# Altium project Mini smart home.PrjPcb
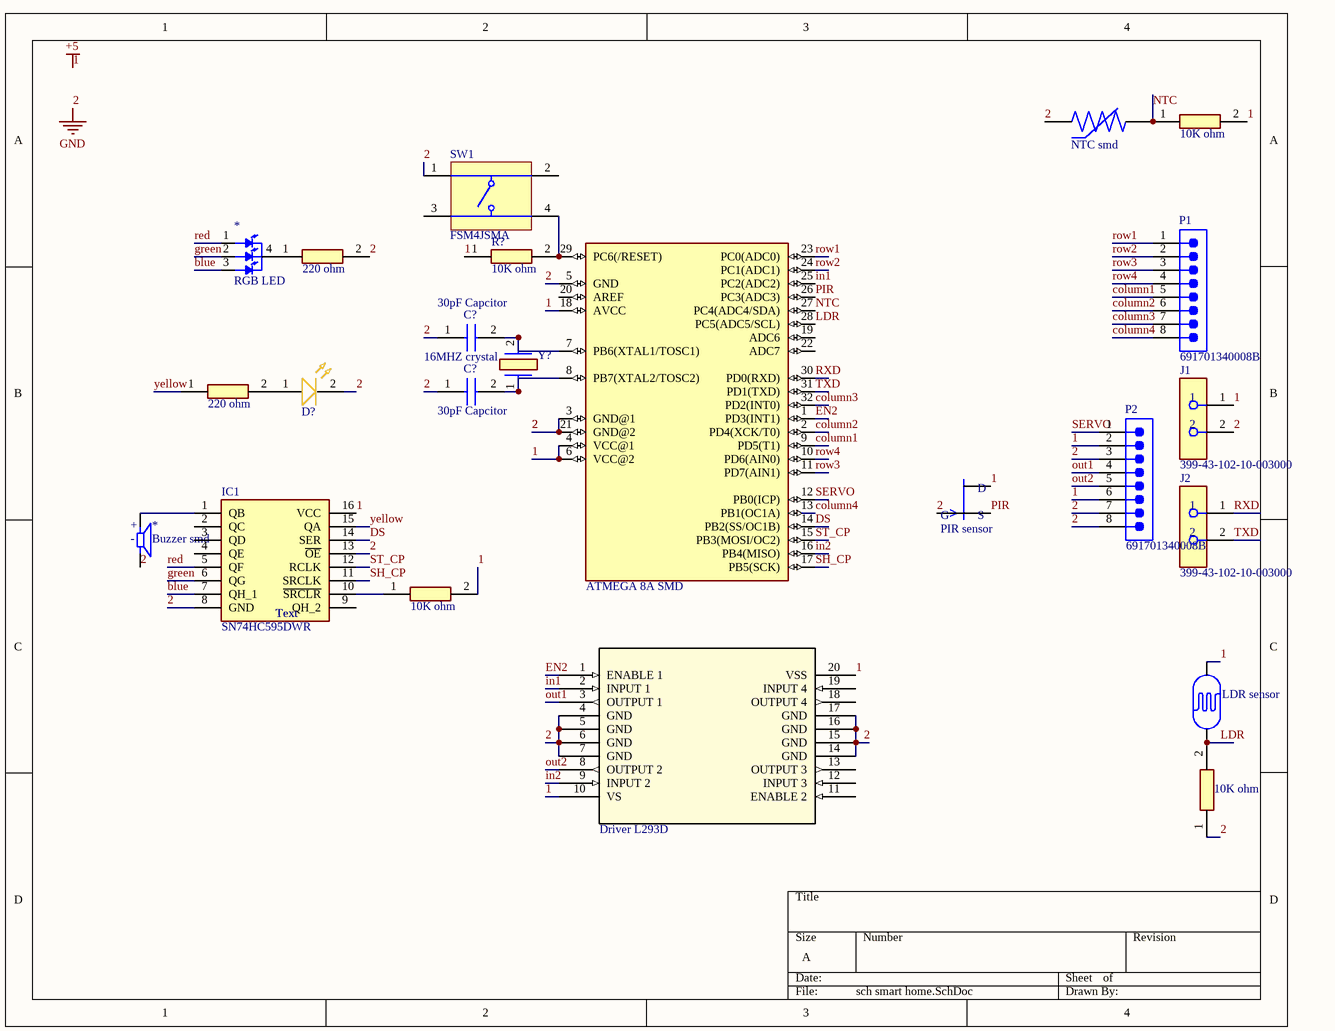
[diagram p0: sch smart home.SchDoc]
1 sheet, 23 parts. Net scope: global (net labels, ports and power ports of the same name join across sheets).
Board file: PCB smart home.PcbDoc

## Sheet sch smart home.SchDoc
size A; SheetNumber: 1; SheetTotal: 1

### Parts
(Parts that share a designator on the sheet are numbered #1, #2 ... from top to bottom, then left to right.)
16MHZ_Crystal  16MHZ crystal  [16MHZ crystal]
Buzzer  NTC smd  [NTC smd]
C1  30pF Capcitor  [30pF Capcitor]
C2  30pF Capcitor  [30pF Capcitor]
D1  LED  [LED]  (value not drawn)
IC1  SN74HC595DWR  [HC595N]
J1  399-43-102-10-003000  [FP-399-43-102-10-003000-MFG]
J2  399-43-102-10-003000  [FP-399-43-102-10-003000-MFG]
L293D_Driver  Driver L293D  [L293D]
LDR  LDR sensor  [LDR sensor]
Mini_Smart_Home  Buzzer smd  [buzzer smd]
NTC  ATMEGA 8A SMD  [ATMEGA 8A SMD]
P1  691701340008B  [691701340008B]
P2  691701340008B  [691701340008B]
PIR_sensor  PIR sensor  [PIR sensor]
R2  10K ohm  [10k OHM]
R#1  10K ohm  [10k OHM]
R#2  220 ohm  [220 OHM]
R#3  220 ohm  [220 OHM]
R#4  10K ohm  [10k OHM]
R#5  10K ohm  [10k OHM]
RGB  RGB LED  [RGB LED]
SW1  FSM4JSMA  [TECO-FSM4JSMA_V]

### Nets
1: IC1.16(VCC) J1.1 L293D_Driver.10(VS) L293D_Driver.20(VSS) LDR.2 NTC.4(VCC@1) NTC.6(VCC@2) NTC.18(AVCC) P2.2 P2.6 PIR_sensor.1(D) R2.1 R#1.2 R#4.2  [also labelled +5]
2: Buzzer.1 C1.1 C2.1 D1.2 IC1.8(GND) IC1.13(~{OE}) J1.2 L293D_Driver.4(GND) L293D_Driver.5(GND) L293D_Driver.6(GND) L293D_Driver.7(GND) L293D_Driver.14(GND) L293D_Driver.15(GND) L293D_Driver.16(GND) L293D_Driver.17(GND) Mini_Smart_Home.2(N) NTC.3(GND@1) NTC.5(GND) NTC.21(GND@2) P2.3 P2.7 P2.8 PIR_sensor.3(G) R#2.2 R#5.1 SW1.1  [also labelled GND]
blue: IC1.7(QH_1) RGB.3(BLUE)
column1: NTC.9(PD5(T1)) P1.5
column2: NTC.2(PD4(XCK/T0)) P1.6
column3: NTC.32(PD2(INT0)) P1.7
column4: NTC.13(PB1(OC1A)) P1.8
DS: IC1.14(SER) NTC.14(PB2(SS/OC1B))
EN2: L293D_Driver.1(ENABLE_1) NTC.1(PD3(INT1))
green: IC1.6(QG) RGB.2(GREEN)
in1: L293D_Driver.2(INPUT_1) NTC.25(PC2(ADC2))
in2: L293D_Driver.9(INPUT_2) NTC.16(PB4(MISO))
LDR: LDR.1 NTC.28(PC5(ADC5/SCL)) R#5.2
NTC: Buzzer.2 NTC.27(PC4(ADC4/SDA)) R#1.1
out1: L293D_Driver.3(OUTPUT_1) P2.4
out2: L293D_Driver.8(OUTPUT_2) P2.5
PIR: NTC.26(PC3(ADC3)) PIR_sensor.2(S)
red: IC1.5(QF) RGB.1(RED)
row1: NTC.23(PC0(ADC0)) P1.1
row2: NTC.24(PC1(ADC1)) P1.2
row3: NTC.11(PD7(AIN1)) P1.3
row4: NTC.10(PD6(AIN0)) P1.4
RXD: J2.1 NTC.30(PD0(RXD))
SERVO: NTC.12(PB0(ICP)) P2.1
SH_CP: IC1.11(SRCLK) NTC.17(PB5(SCK))
ST_CP: IC1.12(RCLK) NTC.15(PB3(MOSI/OC2))
TXD: J2.2 NTC.31(PD1(TXD))
yellow: IC1.15(QA) R#3.1
Net16MHZ_Crystal_1: 16MHZ_Crystal.1 C2.2 NTC.8(PB7(XTAL2/TOSC2))
Net16MHZ_Crystal_2: 16MHZ_Crystal.2 C1.2 NTC.7(PB6(XTAL1/TOSC1))
NetD1_1: D1.1 R#3.2
NetIC1_1: IC1.1(QB) Mini_Smart_Home.1(P)
NetIC1_10: IC1.10(~{SRCLR}) R#4.1
NetNTC_29: NTC.29(PC6(/RESET)) R2.2 SW1.4
NetR#2_1: R#2.1 RGB.4(CATHODE)

Not connected (* = marked no-connect by the designer): IC1 2(QC) 3(QD) 4(QE) 9(QH_2); L293D_Driver 11(ENABLE_2) 12(INPUT_3) 13(OUTPUT_3) 18(OUTPUT_4) 19(INPUT_4); NTC 19(ADC6) 20(AREF) 22(ADC7); SW1 2 3

### Notes on the sheet
- (near IC1) Text
- (in symbol Buzzer smd) +; -

### Library data of the parts
16MHZ_Crystal = 16MHZ crystal: Crystal or Oscillator; Manufacturer_Name: ECS; Manufacturer_Part_Number: ECS-160-20-3X-TR
Buzzer = NTC smd: Manufacturer:: Panasonic Electronic Components; Manufacturer Part Number:: ERT-JZEG103FA
C1 C2 = 30pF Capcitor: Capacitor; Manufacturer_Name: Kyocera AVX; Manufacturer_Part_Number: 06031A300FAT2A
D1 = LED: LED YELLOW CLEAR 0603 SMD; Manufacturer Part Number: 150060AS75000; Manufacturer: Wurth Elektronik; Match Code: WL-SMCW; Case/Size Code: 0603; Chip Technology: AlInGaP; Dominant Wavelength: 605nm; Emitting Color: Amber; Forward Voltage: 2V; Luminous Intensity: 130mcd; Peak Wavelength: 610nm; Viewing Angle: 140°
IC1 = SN74HC595DWR: Integrated Circuit; Manufacturer_Name: Texas Instruments; Manufacturer_Part_Number: SN74HC595DWR; Mouser Part Number: 595-SN74HC595DWR; Supplier Part Number: SN74HC595DWR; Supplier: Texas Instruments
J1 J2 = CMP-07791-000017-1: CONN RCPT 2POS 0.1 GOLD PCB R/A; Pitch: 0.1inch; Connector Type: Receptacle; Number of Positions: 2; Mount: Through Hole; Packaging: Bulk; Color: Black; RoHS Compliant: Yes; Termination: Solder; Number of Rows: 1; Contact Plating: Gold; Package Quantity: 1
L293D_Driver = Driver L293D: IC MTR DRV BIPOLR 4.5-36V 20SOIC; Manufacturer:: STMmicroelectronics; Manufacturer Product Number:: L293DD
LDR = LDR sensor: PHOTO CELL (CDS PHOTORESISTOR); Manufacturer: Adafruit Industries LLC; Manufacturer Product Number: 161
Mini_Smart_Home = Buzzer smd: Manufacturer: Murata Electronics; Manufacturer Product Number: PKMCS0909E4000-R1
P1 P2 = CMP-1502-02009-2: NexarPartId: 22866725; Voltage Rating: 300V; Number of Contacts: 8; Current Rating: 10A; Connector Type: Terminal Block; Gender: Male; REACH SVHC: Unknown; Contact Plating: Tin; RoHS: Compliant; Lead Pitch: 3.81mm; Housing Material: Polymer; Mount: Through Hole; Contact Material: Brass; Termination: PCB; Packaging: Tape and Reel; Color: Black; Number of Pins: 8
PIR_sensor = PIR sensor: Manufacturer: Zilog; Manufacturer Product Number: ZRE200GE
R2 R#1 R#4 R#5 = 10K ohm: Resistor; Manufacturer_Name: Bourns; Manufacturer_Part_Number: CR2512AJW-103ELF
R#2 R#3 = 220 ohm: Resistor; Manufacturer_Name: Walsin Technology Corporation; Manufacturer_Part_Number: WR08X2200FTL; Datasheet Link: https://www.arrow.com/en/products/wr08x2200ftl/walsin-technology; Arrow Part Number: WR08X2200FTL; Arrow Price/Stock: https://www.arrow.com/en/products/wr08x2200ftl/walsin-technology
RGB = RGB LED: LED RGB 0404 SMD; Manufacturer:: Cree LED; Manufacturer Product Number:: UHD1110-FKA-CL1A13R3Q1BBQFMF3
SW1 = CMP-2000-05602-2: Swicth, SPST, 24 V, -35 to 85 degC, 4-Pin SMD, RoHS, Tape and Reel; Manufacturer: TE Connectivity; Switch Travel: 0.25mm; Mechanical Life: 100000Cycles; Contact Current Rating: 50mA; Operating Force: 1.57N; Actuator Material: Polyamide; Contact Resistance: 100mOhm; Voltage Rating: 24V; Illumination Type: Illuminated; Actuator Length: 0.055inch; Max Voltage Rating (DC): 12V; Case\/Package: SMD/SMT; Orientation: Straight; Datasheet URL: http://www.te.com/commerce/DocumentDelivery/DDEController?Action=showdoc&DocId=Customer+Drawing%7F2-1437565-7%7FV%7Fpdf%7FEnglish%7FENG_CD_2-1437565-7_V.pdf%7F4-1437565-2; Min Operating Temperature: -35degC; Packaging: LoosePiece; Termination: GullWing; Throw Configuration: SPST; Package Description: 4-Pin Surface Mount Device, Body 6 x 6 mm, Pitch 4.5 mm; Mounting Technology: SurfaceMount; Contact Plating: Silver; Datasheet Version: Rev. V, 02/2015; RoHSCompliant: true; Max Operating Temperature: 85degC; Length: 6mm; Voltage Rating (DC): 24V; Electrical Life: 100000Cycles; Current Rating: 50mA; Package Quantity: 750; Mount: SurfaceMount; Package Reference: FSM4JSMA; Manufacturer URL: http://www.te.com/; Width: 6mm; REACH SVHC: Unknown; Contact Material: CopperAlloy